# Altium schematic sheet config-power.SchDoc: Config FPGA - Power
size Legal; CheckedBy: J. Brinton; CompanyName: Signal Laboratories, Inc.; DrawnBy: J. Brinton; Engineer: J. Brinton; Address1: 3479 Edison Way; Address2: Menlo Park CA 94025; Address3: +1 (877) 778-8435; Address4: siglabs.com; DocumentNumber: 22; Revision: 2b; SheetNumber: 23; SheetTotal: 58
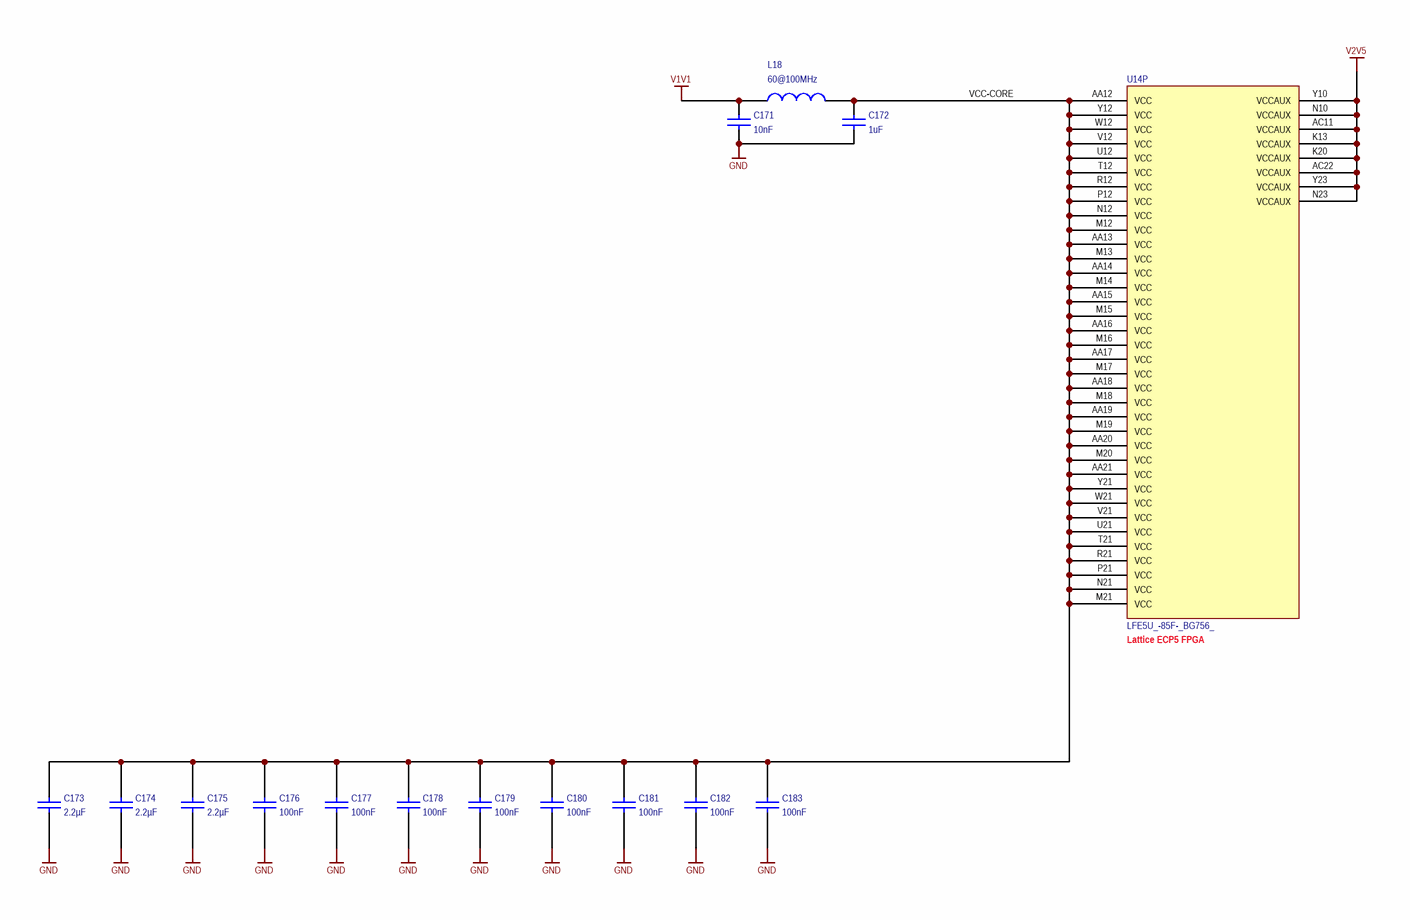
[diagram p0: config-power.SchDoc]

## Parts
C171  value 10nF  [0402]  (hidden comment: GRM155R71E103KA01D)
C172  value 1uF  [0402]  (hidden comment: GRM155R61A105KE15D)
C173  value 2.2µF  [CAPC1608X90N]  (hidden comment: GRM21BR71C225KA12L)
C174  value 2.2µF  [CAPC1608X90N]  (hidden comment: GRM21BR71C225KA12L)
C175  value 2.2µF  [CAPC1608X90N]  (hidden comment: GRM21BR71C225KA12L)
C176  value 100nF  [CAPC1005X56N]  (hidden comment: GRM155R71C104KA88J)
C177  value 100nF  [CAPC1005X56N]  (hidden comment: GRM155R71C104KA88J)
C178  value 100nF  [CAPC1005X56N]  (hidden comment: GRM155R71C104KA88J)
C179  value 100nF  [CAPC1005X56N]  (hidden comment: GRM155R71C104KA88J)
C180  value 100nF  [CAPC1005X56N]  (hidden comment: GRM155R71C104KA88J)
C181  value 100nF  [CAPC1005X56N]  (hidden comment: GRM155R71C104KA88J)
C182  value 100nF  [CAPC1005X56N]  (hidden comment: GRM155R71C104KA88J)
C183  value 100nF  [CAPC1005X56N]  (hidden comment: GRM155R71C104KA88J)
L18  value 60@100MHz  [0402]  (hidden comment: BLM15PX600SN1D)
U14  LFE5U_-85F-_BG756_  [caBGA756]  (part P of 19)

## Nets
GND: C171.1 C172.1 C173.1 C174.1 C175.1 C176.1 C177.1 C178.1 C179.1 C180.1 C181.1 C182.1 C183.1
V1V1: C171.2 L18.1
V2V5: U14.AC11(VCCAUX) U14.AC22(VCCAUX) U14.K13(VCCAUX) U14.K20(VCCAUX) U14.N10(VCCAUX) U14.N23(VCCAUX) U14.Y10(VCCAUX) U14.Y23(VCCAUX)
VCC-CORE: C172.2 C173.2 C174.2 C175.2 C176.2 C177.2 C178.2 C179.2 C180.2 C181.2 C182.2 C183.2 L18.2 U14.AA12(VCC) U14.AA13(VCC) U14.AA14(VCC) U14.AA15(VCC) U14.AA16(VCC) U14.AA17(VCC) U14.AA18(VCC) U14.AA19(VCC) U14.AA20(VCC) U14.AA21(VCC) U14.M12(VCC) U14.M13(VCC) U14.M14(VCC) U14.M15(VCC) U14.M16(VCC) U14.M17(VCC) U14.M18(VCC) U14.M19(VCC) U14.M20(VCC) U14.M21(VCC) U14.N12(VCC) U14.N21(VCC) U14.P12(VCC) U14.P21(VCC) U14.R12(VCC) U14.R21(VCC) U14.T12(VCC) U14.T21(VCC) U14.U12(VCC) U14.U21(VCC) U14.V12(VCC) U14.V21(VCC) U14.W12(VCC) U14.W21(VCC) U14.Y12(VCC) U14.Y21(VCC)

## Notes on the sheet
- (near U14) Lattice ECP5 FPGA
- Title
- Engineer
- Revision
- Drawn By
- Checked By
- Date
- Sheet
- of

## Library data of the parts
C171 = CAP 0402: Ceramic Capacitor 10nF ±10% 25V X7R 0402; Manufacturer: Murata; Tr: -55:125; Voltage: 25V; Manufacturer P/N: GRM155R71E103KA01D; Package: 0402; Tolerance: ±10%
C172 = CAP 0402: Ceramic Capacitor 1uF ±10% 10V X5R 0402; Manufacturer: Murata; Tr: -55:125; Voltage: 10V; Manufacturer P/N: GRM155R61A105KE15D; Package: 0402; Tolerance: ±10%
C173-C175 = GRM188R71A225KE15D: Ceramic Capacitor 2.2uF ±10% 10V X7R 0603; Manufacturer: Murata; Tr: -55:125; Manufacturer P/N: GRM188R71A225KE15D; Tolerance: ±10%; Package: 0603; Voltage: 10V
C176-C183 = GRM155R71A104KA01J: Ceramic Capacitor 100nF ±10% 16V X7R 0402; Manufacturer: Murata; Tr: -55:125; Manufacturer P/N: GRM155R71C104KA88J; Tolerance: ±10%; Package: 0402; Voltage: 16V
L18 = IND 0402: Ferrite Bead 60-Ohm @ 100MHz 2.5A 0402; Manufacturer: Murata; Tolerance: ±25%; Tr: -55:125; Manufacturer P/N: BLM15PX600SN1D; Package: 0402
U14 = LFE5U_-85F-_BG756_: ECP5 FPGA, 85k LUT, 756-caBGA; Manufacturer: Lattice Semiconductor; Manufacturer P/N: LFE5U_-85F-_BG756_